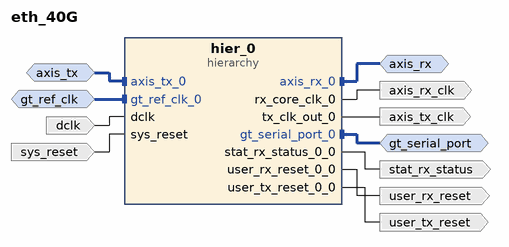
[diagram p0: block diagram of the top level]
# Vivado block design eth_40G, xcvu37p-fsvh2892-2L-e, Vivado 2023.2
create_bd_design eth_40G

create_bd_intf_port -mode Slave -vlnv xilinx.com:interface:diff_clock_rtl:1.0 gt_ref_clk
set_property -dict {CONFIG.FREQ_HZ 156250000} [get_bd_intf_ports gt_ref_clk]
create_bd_intf_port -mode Master -vlnv xilinx.com:interface:gt_rtl:1.0 gt_serial_port
create_bd_intf_port -mode Master -vlnv xilinx.com:interface:axis_rtl:1.0 axis_rx
create_bd_intf_port -mode Slave -vlnv xilinx.com:interface:axis_rtl:1.0 axis_tx
set_property -dict [list \
  CONFIG.HAS_TKEEP 0 \
  CONFIG.HAS_TLAST 0 \
  CONFIG.HAS_TREADY 1 \
  CONFIG.HAS_TSTRB 0 \
  CONFIG.LAYERED_METADATA undef \
  CONFIG.TDATA_NUM_BYTES 16 \
  CONFIG.TDEST_WIDTH 0 \
  CONFIG.TID_WIDTH 0 \
  CONFIG.TUSER_WIDTH 70 \
] [get_bd_intf_ports axis_tx]
create_bd_port -dir O stat_rx_status
create_bd_port -dir I -type rst sys_reset
set_property -dict {CONFIG.POLARITY ACTIVE_HIGH} [get_bd_ports sys_reset]
create_bd_port -dir O -type clk axis_tx_clk
set_property -dict {CONFIG.ASSOCIATED_BUSIF axis_tx CONFIG.ASSOCIATED_RESET user_tx_reset} [get_bd_ports axis_tx_clk]
create_bd_port -dir O -type clk axis_rx_clk
set_property -dict {CONFIG.ASSOCIATED_BUSIF axis_rx CONFIG.ASSOCIATED_RESET user_rx_reset} [get_bd_ports axis_rx_clk]
create_bd_port -dir I -type clk dclk
set_property -dict {CONFIG.FREQ_HZ 100000000} [get_bd_ports dclk]
create_bd_port -dir O -type rst user_rx_reset
create_bd_port -dir O -type rst user_tx_reset

create_bd_cell -type hier hier_0

# ---- hierarchy /hier_0 ----
current_bd_instance /hier_0
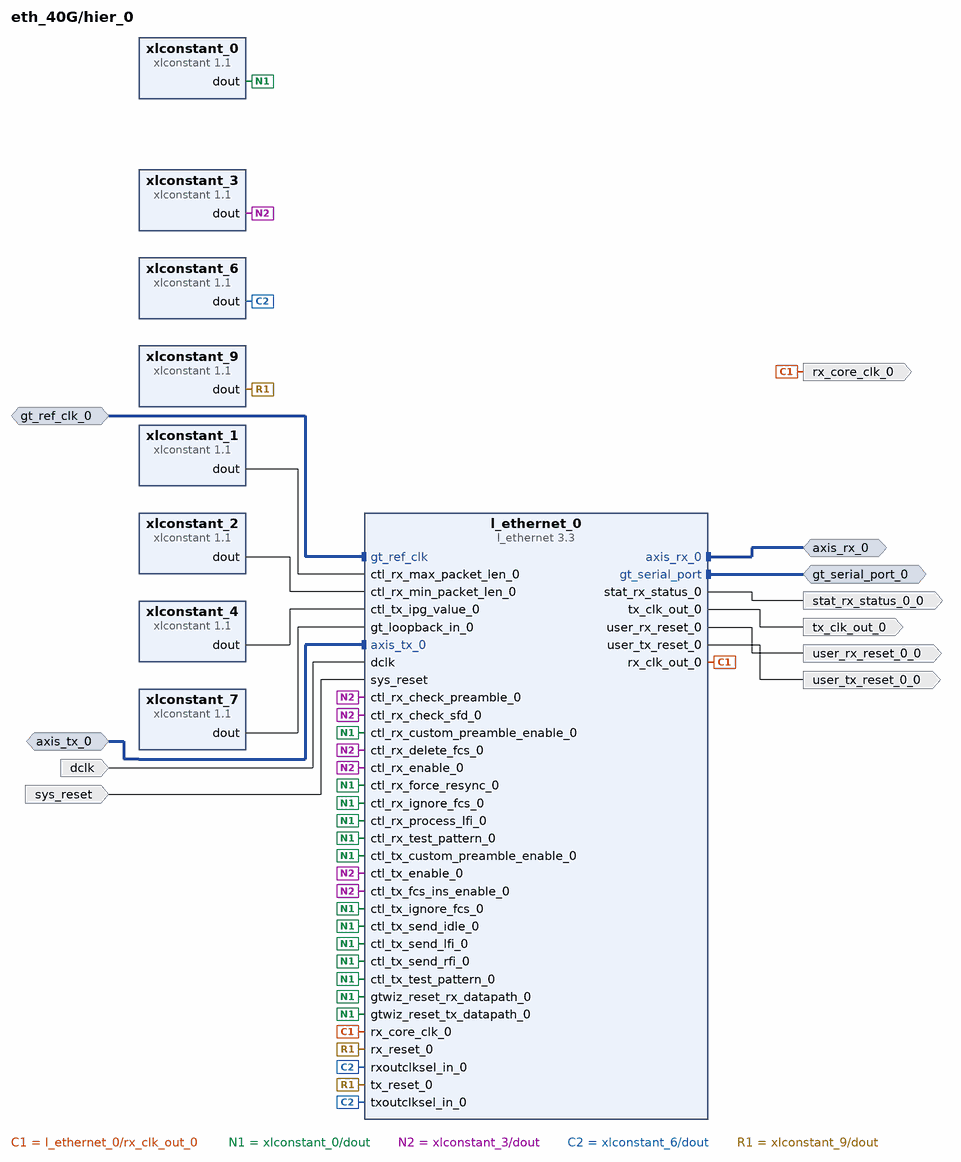
[diagram p1: block diagram inside /hier_0]
create_bd_intf_pin -mode Master -vlnv xilinx.com:interface:gt_rtl:1.0 gt_serial_port_0
create_bd_intf_pin -mode Slave -vlnv xilinx.com:interface:diff_clock_rtl:1.0 gt_ref_clk_0
create_bd_intf_pin -mode Master -vlnv xilinx.com:interface:axis_rtl:1.0 axis_rx_0
create_bd_intf_pin -mode Slave -vlnv xilinx.com:interface:axis_rtl:1.0 axis_tx_0
create_bd_pin -dir I -type rst sys_reset
create_bd_pin -dir O -type clk tx_clk_out_0
create_bd_pin -dir O -type clk rx_core_clk_0
create_bd_pin -dir O stat_rx_status_0_0
create_bd_pin -dir I -type clk dclk
create_bd_pin -dir O -type rst user_rx_reset_0_0
create_bd_pin -dir O -type rst user_tx_reset_0_0

create_bd_cell -type ip -vlnv xilinx.com:ip:xlconstant:1.1 xlconstant_9
set_property -dict {CONFIG.CONST_VAL 0} [get_bd_cells xlconstant_9]
create_bd_cell -type ip -vlnv xilinx.com:ip:l_ethernet:3.3 l_ethernet_0
set_property -dict [list \
  CONFIG.BASE_R_KR BASE-R \
  CONFIG.DATA_PATH_INTERFACE {128-bit Straddled AXI4-Stream} \
  CONFIG.DIFFCLK_BOARD_INTERFACE qsfp1_156mhz \
  CONFIG.ETHERNET_BOARD_INTERFACE qsfp1_4x \
  CONFIG.GT_DRP_CLK 100 \
  CONFIG.GT_REF_CLK_FREQ 156.25 \
  CONFIG.INCLUDE_AXI4_INTERFACE 0 \
  CONFIG.LINE_RATE 40 \
] [get_bd_cells l_ethernet_0]
create_bd_cell -type ip -vlnv xilinx.com:ip:xlconstant:1.1 xlconstant_0
set_property -dict {CONFIG.CONST_VAL 0} [get_bd_cells xlconstant_0]
create_bd_cell -type ip -vlnv xilinx.com:ip:xlconstant:1.1 xlconstant_1
set_property -dict {CONFIG.CONST_VAL 9600 CONFIG.CONST_WIDTH 15} [get_bd_cells xlconstant_1]
create_bd_cell -type ip -vlnv xilinx.com:ip:xlconstant:1.1 xlconstant_2
set_property -dict {CONFIG.CONST_VAL 64 CONFIG.CONST_WIDTH 8} [get_bd_cells xlconstant_2]
create_bd_cell -type ip -vlnv xilinx.com:ip:xlconstant:1.1 xlconstant_3
create_bd_cell -type ip -vlnv xilinx.com:ip:xlconstant:1.1 xlconstant_4
set_property -dict {CONFIG.CONST_VAL 12 CONFIG.CONST_WIDTH 4} [get_bd_cells xlconstant_4]
create_bd_cell -type ip -vlnv xilinx.com:ip:xlconstant:1.1 xlconstant_6
set_property -dict {CONFIG.CONST_VAL b101101101101 CONFIG.CONST_WIDTH 12} [get_bd_cells xlconstant_6]
create_bd_cell -type ip -vlnv xilinx.com:ip:xlconstant:1.1 xlconstant_7
set_property -dict {CONFIG.CONST_VAL 0 CONFIG.CONST_WIDTH 12} [get_bd_cells xlconstant_7]

# ---- connections ----

current_bd_instance /hier_0
connect_bd_intf_net -intf_net gt_ref_clk_0_1 [get_bd_intf_pins gt_ref_clk_0] [get_bd_intf_pins l_ethernet_0/gt_ref_clk]
connect_bd_intf_net [get_bd_intf_pins axis_rx_0] [get_bd_intf_pins l_ethernet_0/axis_rx_0]
connect_bd_intf_net [get_bd_intf_pins gt_serial_port_0] [get_bd_intf_pins l_ethernet_0/gt_serial_port]
connect_bd_intf_net -intf_net tx_0_outdata_axis [get_bd_intf_pins axis_tx_0] [get_bd_intf_pins l_ethernet_0/axis_tx_0]
connect_bd_net -net dclk_1_1 [get_bd_pins dclk] [get_bd_pins l_ethernet_0/dclk]
connect_bd_net [get_bd_pins l_ethernet_0/rx_clk_out_0] [get_bd_pins rx_core_clk_0] [get_bd_pins l_ethernet_0/rx_core_clk_0]
connect_bd_net [get_bd_pins l_ethernet_0/stat_rx_status_0] [get_bd_pins stat_rx_status_0_0]
connect_bd_net [get_bd_pins l_ethernet_0/tx_clk_out_0] [get_bd_pins tx_clk_out_0]
connect_bd_net [get_bd_pins l_ethernet_0/user_rx_reset_0] [get_bd_pins user_rx_reset_0_0]
connect_bd_net [get_bd_pins l_ethernet_0/user_tx_reset_0] [get_bd_pins user_tx_reset_0_0]
connect_bd_net -net proc_sys_reset_0_peripheral_reset [get_bd_pins sys_reset] [get_bd_pins l_ethernet_0/sys_reset]
connect_bd_net [get_bd_pins xlconstant_0/dout] \
  [get_bd_pins l_ethernet_0/gtwiz_reset_tx_datapath_0] [get_bd_pins l_ethernet_0/gtwiz_reset_rx_datapath_0] \
  [get_bd_pins l_ethernet_0/ctl_rx_test_pattern_0] [get_bd_pins l_ethernet_0/ctl_rx_ignore_fcs_0] \
  [get_bd_pins l_ethernet_0/ctl_rx_custom_preamble_enable_0] [get_bd_pins l_ethernet_0/ctl_rx_process_lfi_0] \
  [get_bd_pins l_ethernet_0/ctl_rx_force_resync_0] [get_bd_pins l_ethernet_0/ctl_tx_test_pattern_0] \
  [get_bd_pins l_ethernet_0/ctl_tx_send_lfi_0] [get_bd_pins l_ethernet_0/ctl_tx_send_rfi_0] \
  [get_bd_pins l_ethernet_0/ctl_tx_send_idle_0] [get_bd_pins l_ethernet_0/ctl_tx_custom_preamble_enable_0] \
  [get_bd_pins l_ethernet_0/ctl_tx_ignore_fcs_0]
connect_bd_net [get_bd_pins xlconstant_1/dout] [get_bd_pins l_ethernet_0/ctl_rx_max_packet_len_0]
connect_bd_net [get_bd_pins xlconstant_2/dout] [get_bd_pins l_ethernet_0/ctl_rx_min_packet_len_0]
connect_bd_net [get_bd_pins xlconstant_3/dout] \
  [get_bd_pins l_ethernet_0/ctl_rx_enable_0] [get_bd_pins l_ethernet_0/ctl_rx_delete_fcs_0] \
  [get_bd_pins l_ethernet_0/ctl_rx_check_sfd_0] [get_bd_pins l_ethernet_0/ctl_rx_check_preamble_0] \
  [get_bd_pins l_ethernet_0/ctl_tx_enable_0] [get_bd_pins l_ethernet_0/ctl_tx_fcs_ins_enable_0]
connect_bd_net [get_bd_pins xlconstant_4/dout] [get_bd_pins l_ethernet_0/ctl_tx_ipg_value_0]
connect_bd_net [get_bd_pins xlconstant_6/dout] [get_bd_pins l_ethernet_0/txoutclksel_in_0] [get_bd_pins l_ethernet_0/rxoutclksel_in_0]
connect_bd_net [get_bd_pins xlconstant_7/dout] [get_bd_pins l_ethernet_0/gt_loopback_in_0]
connect_bd_net [get_bd_pins xlconstant_9/dout] [get_bd_pins l_ethernet_0/rx_reset_0] [get_bd_pins l_ethernet_0/tx_reset_0]

current_bd_instance /
connect_bd_intf_net -intf_net axis_tx_0_0_1 [get_bd_intf_ports axis_tx] [get_bd_intf_pins hier_0/axis_tx_0]
connect_bd_intf_net -intf_net gt_ref_clk_0_1 [get_bd_intf_ports gt_ref_clk] [get_bd_intf_pins hier_0/gt_ref_clk_0]
connect_bd_intf_net [get_bd_intf_ports axis_rx] [get_bd_intf_pins hier_0/axis_rx_0]
connect_bd_intf_net -intf_net l_ethernet_0_gt_serial_port [get_bd_intf_ports gt_serial_port] [get_bd_intf_pins hier_0/gt_serial_port_0]
connect_bd_net -net dclk_1_1 [get_bd_ports dclk] [get_bd_pins hier_0/dclk]
connect_bd_net [get_bd_pins hier_0/rx_core_clk_0] [get_bd_ports axis_rx_clk]
connect_bd_net [get_bd_pins hier_0/tx_clk_out_0] [get_bd_ports axis_tx_clk]
connect_bd_net [get_bd_pins hier_0/user_rx_reset_0_0] [get_bd_ports user_rx_reset]
connect_bd_net [get_bd_pins hier_0/user_tx_reset_0_0] [get_bd_ports user_tx_reset]
connect_bd_net -net l_ethernet_0_stat_rx_status_0 [get_bd_pins hier_0/stat_rx_status_0_0] [get_bd_ports stat_rx_status]
connect_bd_net -net sys_reset_0_1 [get_bd_ports sys_reset] [get_bd_pins hier_0/sys_reset]

validate_bd_design
save_bd_design
